# EAGLE design TopPanel (EAGLE 9.1.3)
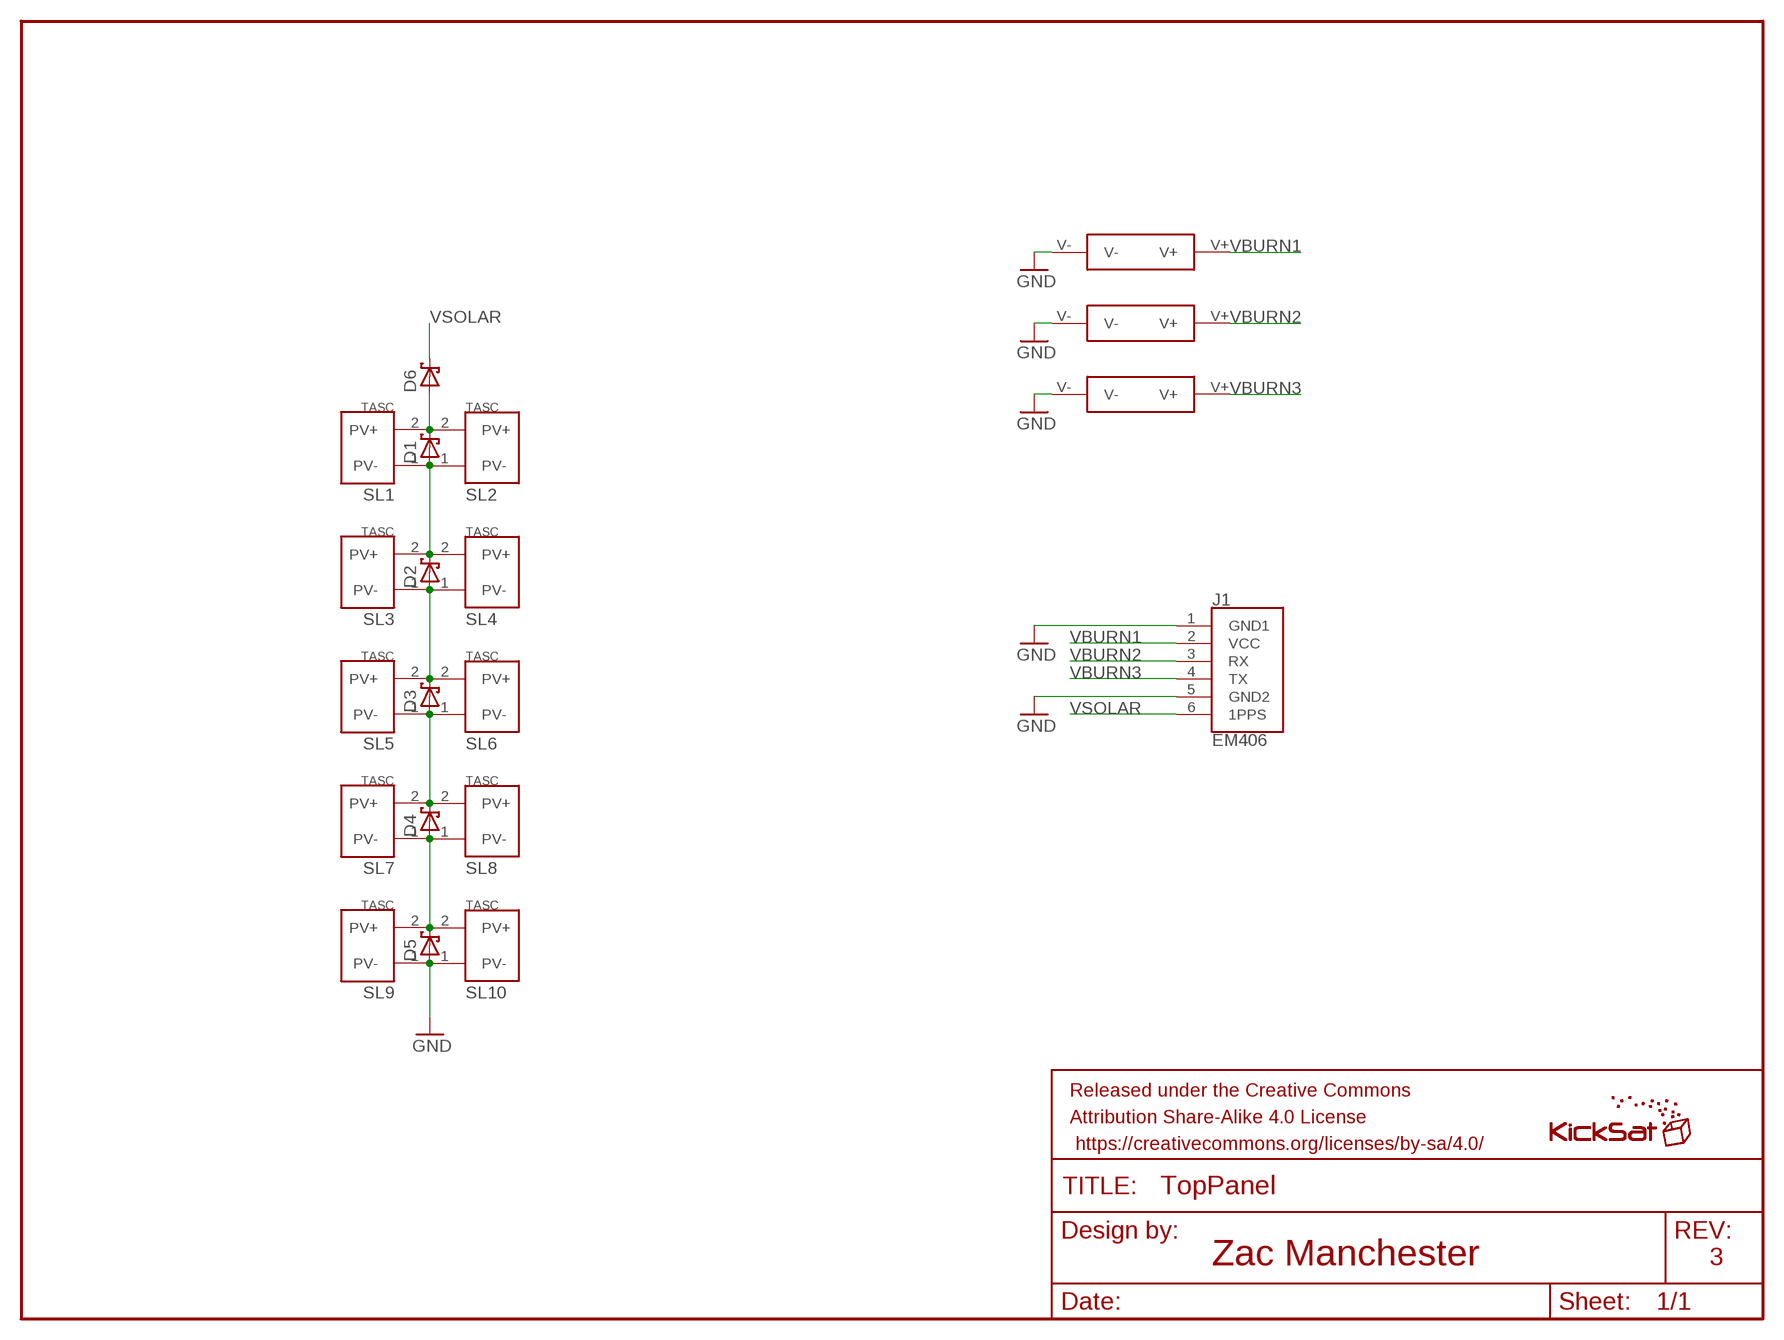
[diagram p0: schematic, sheet 1]

## Parts
D1  SB_DIODE  [SB_DIODE]
D2  SB_DIODE  [SB_DIODE]
D3  SB_DIODE  [SB_DIODE]
D4  SB_DIODE  [SB_DIODE]
D5  SB_DIODE  [SB_DIODE]
D6  SB_DIODE  [SB_DIODE]
FRAME1  FRAME-LETTER  [CREATIVE_COMMONS]
J1  EM406  [1X06-1MM]
SL1  SOLAR_CELL  [SOLAR_CELL]
SL2  SOLAR_CELL  [SOLAR_CELL]
SL3  SOLAR_CELL  [SOLAR_CELL]
SL4  SOLAR_CELL  [SOLAR_CELL]
SL5  SOLAR_CELL  [SOLAR_CELL]
SL6  SOLAR_CELL  [SOLAR_CELL]
SL7  SOLAR_CELL  [SOLAR_CELL]
SL8  SOLAR_CELL  [SOLAR_CELL]
SL9  SOLAR_CELL  [SOLAR_CELL]
SL10  SOLAR_CELL  [SOLAR_CELL]
U$1  KICKSAT_LOGO  [KICKSAT_LOGO]
U$2  BURNWIRE  [BURNWIRE]
U$3  BURNWIRE  [BURNWIRE]
U$4  BURNWIRE  [BURNWIRE]

## Nets
GND: D5.POS J1.1(GND1) J1.5(GND2) SL9.1(PV-) SL10.1(PV-) U$2.V- U$3.V- U$4.V-
N$9: D1.NEG D6.POS SL1.2(PV+) SL2.2(PV+)
N$37: D2.POS D3.NEG SL3.1(PV-) SL4.1(PV-) SL5.2(PV+) SL6.2(PV+)
N$39: D3.POS D4.NEG SL5.1(PV-) SL6.1(PV-) SL7.2(PV+) SL8.2(PV+)
N$45: D1.POS D2.NEG SL1.1(PV-) SL2.1(PV-) SL3.2(PV+) SL4.2(PV+)
N$50: D4.POS D5.NEG SL7.1(PV-) SL8.1(PV-) SL9.2(PV+) SL10.2(PV+)
VBURN1: J1.2(VCC) U$2.V+
VBURN2: J1.3(RX) U$3.V+
VBURN3: J1.4(TX) U$4.V+
VSOLAR: D6.NEG J1.6(1PPS)

## Notes on the sheet
- Zac Manchester | 3

## Library data of the parts
D1-D6 = Solar:SB_DIODE
FRAME1 = SparkFun-Aesthetics:FRAME-LETTER: Schematic Frame Standard 8.5x11 US Letter frame
J1 = SparkFun-Connectors:EM406: EM406 GPS Connector Here is a six pin vertical 1.0mm pitch connector. It is useful if you need something very tiny as a connection. These are not the standard JST type connectors we use on most of our boards, but are actually the much smaller JST-SH type. Here is the connector we sell at SparkFun: JST SH Vertical 6-Pin Connector - SMD <https://www.sparkfun.com/products/579> (GPS-00579) Datasheet <http://www.sparkfun.com/datasheets/GPS/EM406-SMDConnector-eSH.pdf> It was used on these SparkFun products: SparkFun GPS Breakout <https://www.sparkfun.com/products/11818> (BOB-11818) SparkFun Weather Shield <https://www.sparkfun.com/products/12081> (DEV-12081) And many, many other GPS related products.; PROD_ID: CONN-08249; SF_ID: GPS-00579
SL1-SL10 = Solar:SOLAR_CELL
U$1 = KickSat-Logo:KICKSAT_LOGO
U$2-U$4 = BurnWire:BURNWIRE

## Board
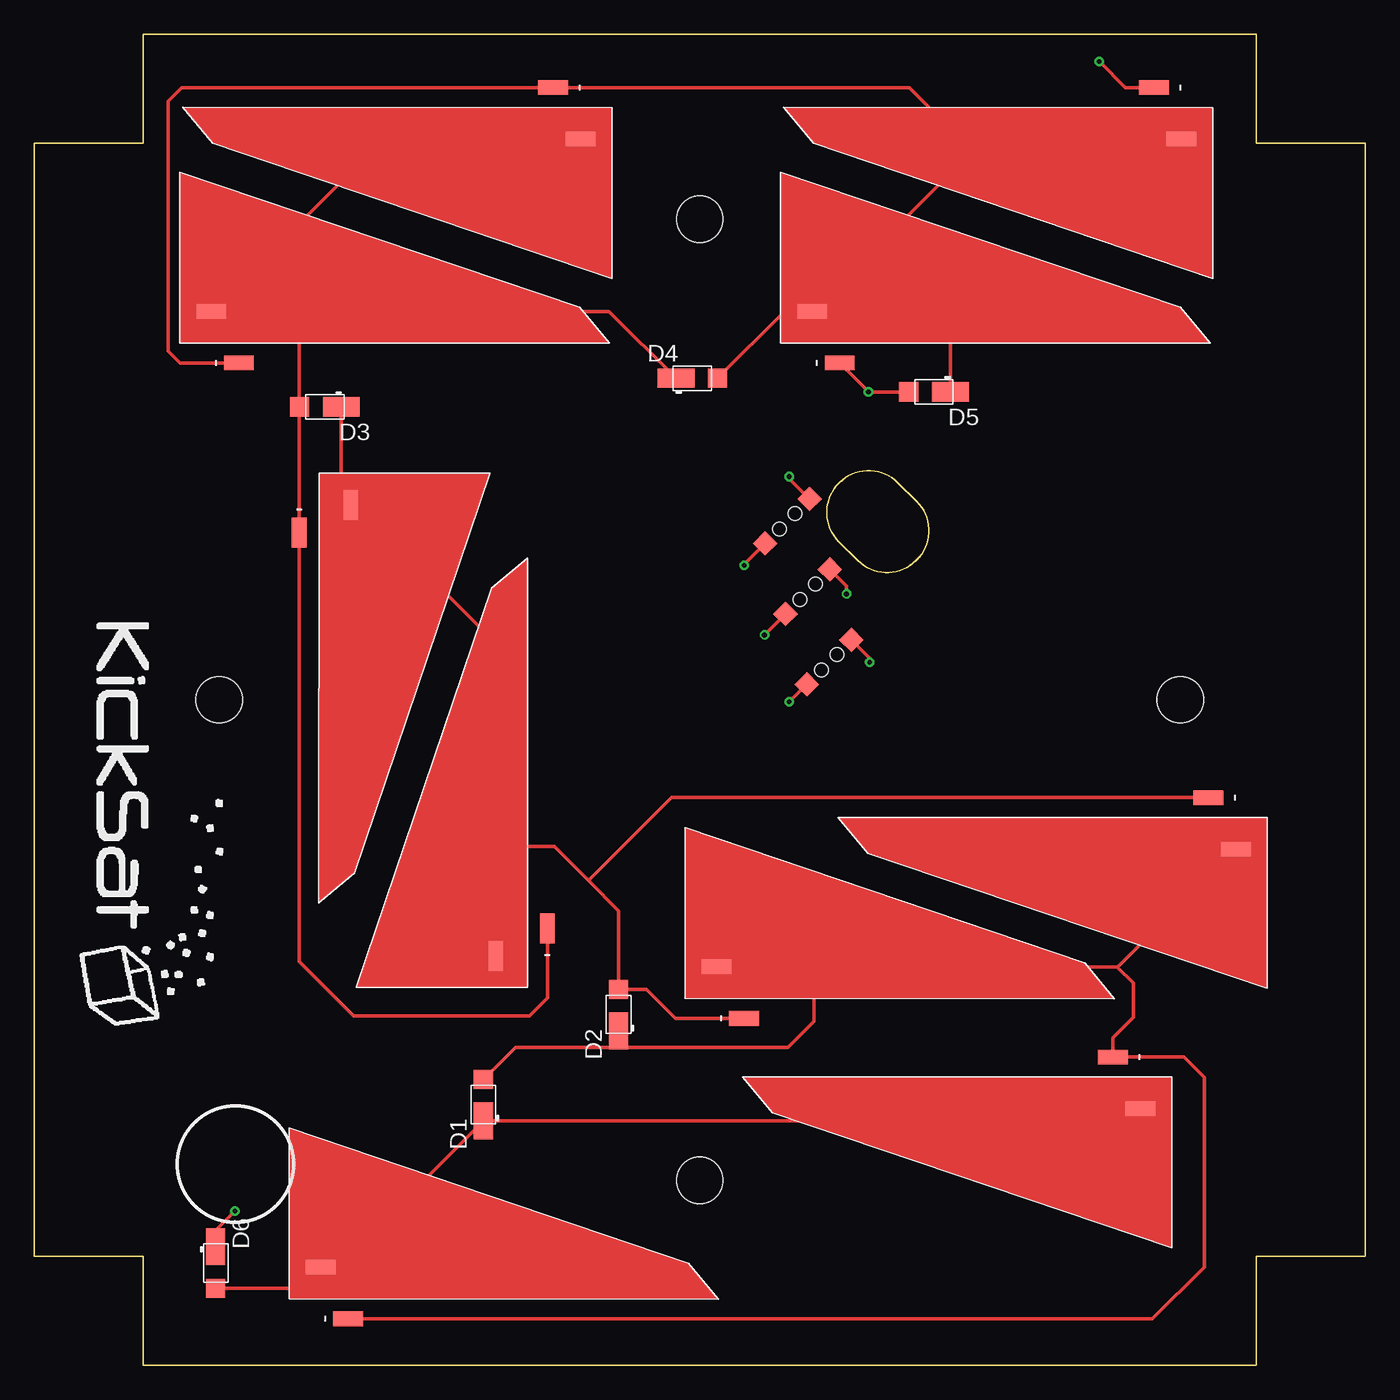
[diagram p1: board, top side]
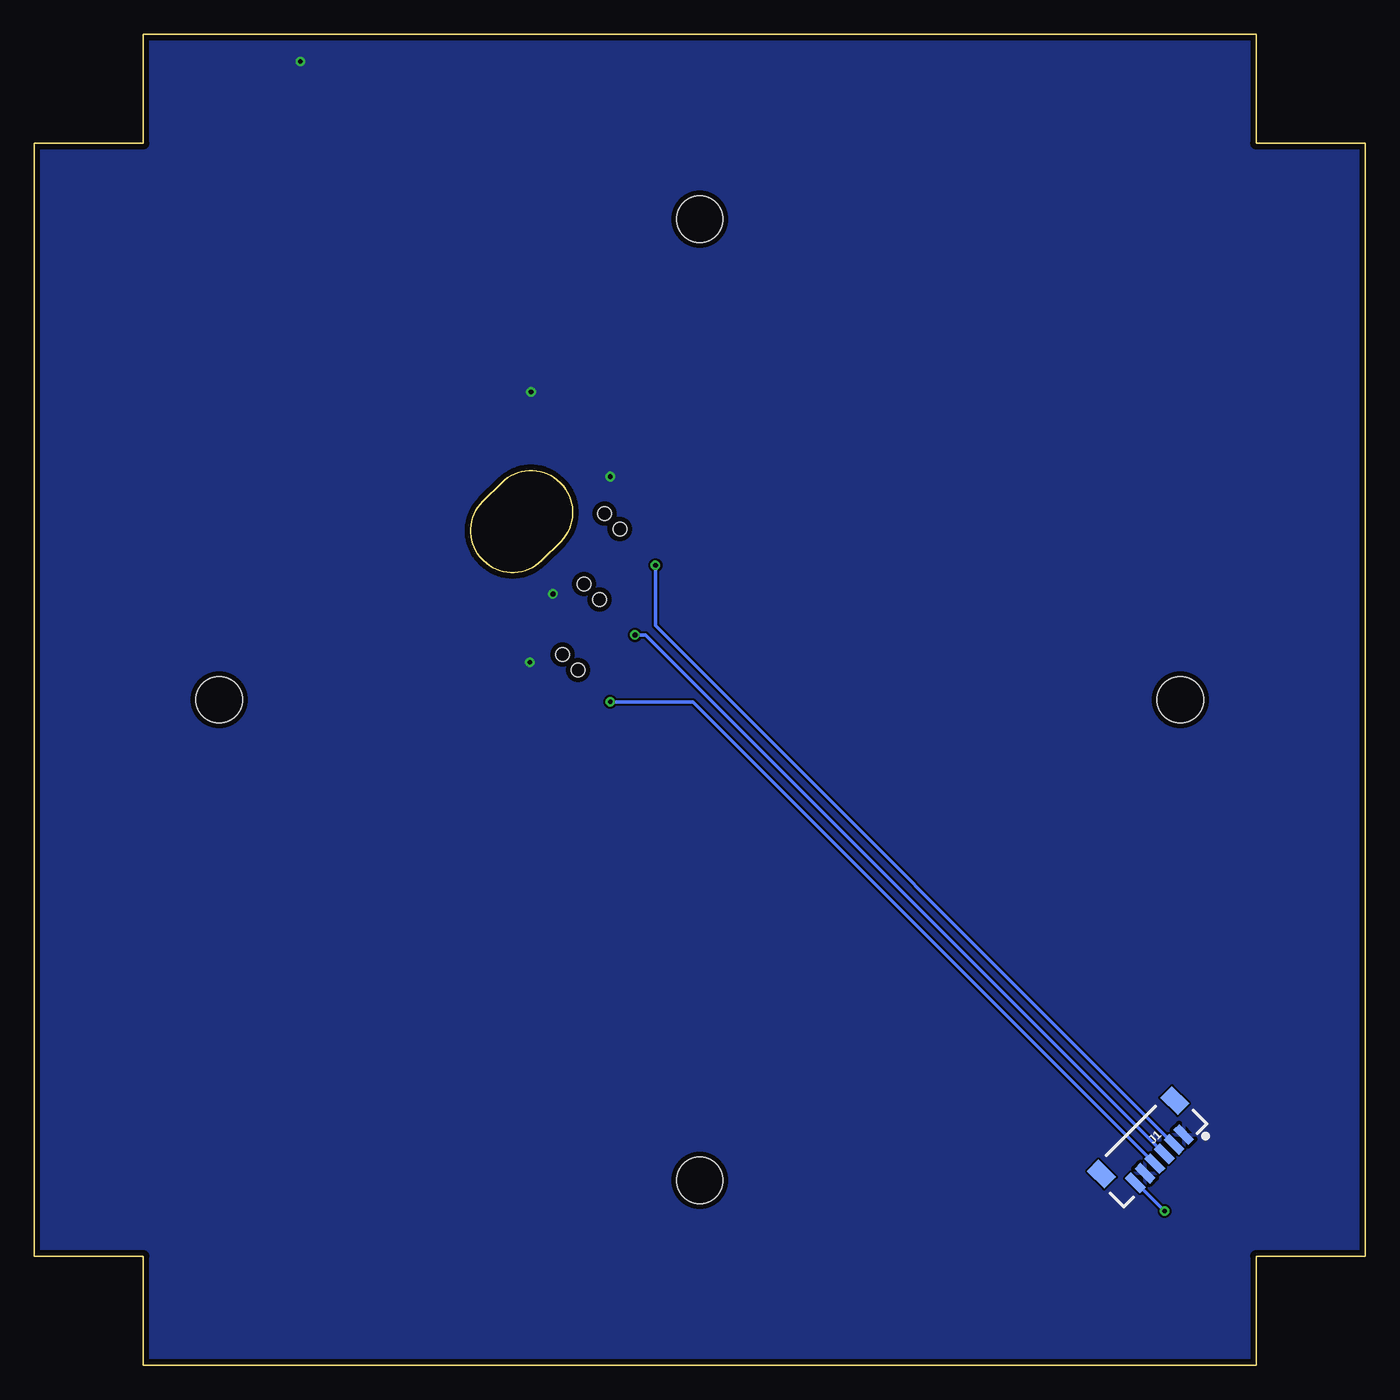
[diagram p2: board, bottom side, seen from below]

Size 97.5 x 97.5 mm. Coordinates in mm from the lower left corner, seen from the top.
Outline: 0,8 8,8 8,0 89.5,0 89.5,8 97.5,8 97.5,89.5 89.5,89.5 89.5,97.5 8,97.5 8,89.5 0,89.5 0,8
Outline: 58.93,64.59 59,64.66 arc-90 63.24,64.66 64.65,63.25 arc-90 64.65,59.01 64.58,58.94 arc-90 60.34,58.94 58.93,60.35 arc-90 58.93,64.59
Copper layers (1*16): Top 0.0356mm / dielectric 1.5011mm / Bottom 0.0356mm
Design rules "OSHPark-2layer": minimum track width 6mil, minimum drill 13mil, track to track 6mil, track to pad 6mil, pad to pad 6mil, via to via 6mil, smd to smd 6mil, copper to edge 15mil, drill to drill 6mil, minimum pad ring 7mil, minimum via ring 7mil, stop-mask expansion 4mil, vias tented up to drill 0mil, thermal gap 10mil
Holes 3.4 mm at 48.75,83.95 13.55,48.75 83.95,48.75 48.75,13.55

### Footprints (pad centres in the part's own frame; a part is rotated, then mirrored left to right if it is on the bottom)
SB_DIODE = smd 2.7 x 1.4: NEG -1.2,0 | smd 1.4 x 1.4: POS 1.85,0
1X06-1MM = smd 0.6 x 1.55: 1 -2.54,1.27; 2 -1.54,1.27; 3 -0.54,1.27; 4 0.46,1.27; 5 1.46,1.27; 6 2.46,1.27 | smd 1.2 x 1.8: P$1 -3.84,-0.955; P$2 3.76,-0.955
SOLAR_CELL = smd 1.067 x 2.184: 1 -1.589,2.999; 2 2.187,5.011
BURNWIRE = smd 1.27 x 1.27: V+ 2.3,0; V- -2.3,0 | hole 1: 0.8,0; -0.8,0

### Placement (x,y rotation side)
D1  32.9,19.1 90 top
D2  42.8,25.7 90 top
D3  21.3,70.2 180 top
D4  48.2,72.3 0 top
D5  65.9,71.3 180 top
D6  13.3,7.5 270 top
FRAME1  70.7,28.6 0 bottom
J1  16,16 225 bottom
SL1  26,5 90 top
SL2  76,21 270 top
SL3  83,40 270 top
SL4  55,27 90 top
SL5  21,58 0 top
SL6  36,35 180 top
SL7  18,75 90 top
SL8  35,92 270 top
SL9  62,75 90 top
SL10  79,92 270 top
U$1  3.1,54.9 270 top
U$2  55.17,61.83 225 top
U$3  56.65,56.67 225 top
U$4  58.22,51.5 225 top

### Tracks (layer width: path | path; a pad name or v marks a point on that pad's centre or on a via)
GND  (via drill 0.35)
  Top 0.254: U$3.V- 59.5,57.08 v59.5,56.5 | U$4.V- 61.2,51.78 v61.2,51.5 | U$2.V- 55.3,64.95 v55.3,65.1 | SL10.1 79.91,93.59 v78,95.5 | SL9.1 61,71.41 61,71.4 v61.1,71.3 D5.POS
  pour Bottom: 0,8 8,8 8,0 89.5,0 89.5,8 97.5,8 97.5,89.5 89.5,89.5 89.5,97.5 8,97.5 8,89.5 0,89.5
N$9
  Top 0.254: SL2.2 80.1,17.9 D1.NEG 22.19,7.19 SL1.2 19.45,5.65 D6.POS
N$37
  Top 0.254: D3.NEG 22.5,64.3 23.3,63.5 23.3,63.4 | 23.3,63.4 23.3,63.12 SL5.2 | SL6.2 33.81,37.9 | 33.81,37.9 33.81,52.89 23.3,63.4 | SL4.1 46.99,25.41 44.85,27.55 D2.POS 42.8,33.3 40.6,35.5 | 40.6,35.5 38.1,38 33.91,38 33.81,37.9 | SL3.1 46.69,41.59 40.6,35.5
N$39
  Top 0.254: SL8.2 25.61,89.81 SL7.2 19.4,77.19 | 19.4,77.19 42.11,77.19 D4.NEG | 19.4,77.19 19.4,70.25 D3.POS 19.41,70.16 SL5.1 19.41,29.59 23.4,25.6 36.3,25.6 37.6,26.9 37.59,26.91 SL6.1
N$45
  Top 0.254: SL4.2 57.1,29.19 | 57.1,29.19 79.39,29.19 79.55,29.35 | 79.55,29.35 SL3.2 | D2.NEG 42.8,23.3 | 57.1,29.19 57.1,25.2 55.2,23.3 42.8,23.3 | D1.POS 35.25,23.3 42.8,23.3 | SL2.1 79,24 80.5,25.5 80.5,28 79.35,29.15 79.55,29.35 | SL2.1 | SL1.1 81.91,3.41 85.7,7.2 85.7,21.1 84.2,22.6 SL2.1
N$50
  Top 0.254: SL10.2 69.61,89.81 68.75,88.95 | 68.75,88.95 57.15,77.35 | 57.15,77.35 SL9.2 54.94,77.19 D4.POS | D5.NEG 67.1,77.35 57.15,77.35 | SL7.1 10.7,73.4 9.8,74.3 9.8,92.6 10.79,93.59 SL8.1 64.11,93.59 68.75,88.95
VBURN1  (via drill 0.35)
  Top 0.254: v52,58.6 52,58.66 U$2.V+
  Bottom 0.254: J1.2 52,54.18 v52,58.6
VBURN2  (via drill 0.35)
  Top 0.254: v53.5,53.5 55.03,55.03 U$3.V+
  Bottom 0.254: J1.3 52.74,53.5 v53.5,53.5
VBURN3  (via drill 0.35)
  Top 0.254: v55.3,48.6 56.57,49.87 U$4.V+
  Bottom 0.254: J1.4 49.25,48.6 v55.3,48.6
VSOLAR  (via drill 0.35)
  Top 0.254: D6.NEG 13.3,9.9 v14.7,11.3
  Bottom 0.254: v14.7,11.3 16.76,13.36 J1.6